# Altium schematic sheet USER_IO.SchDoc
size Tabloid; SheetNumber: 14; SheetTotal: 25; Sheet_Name: MECHANICAL; Size: 11x17
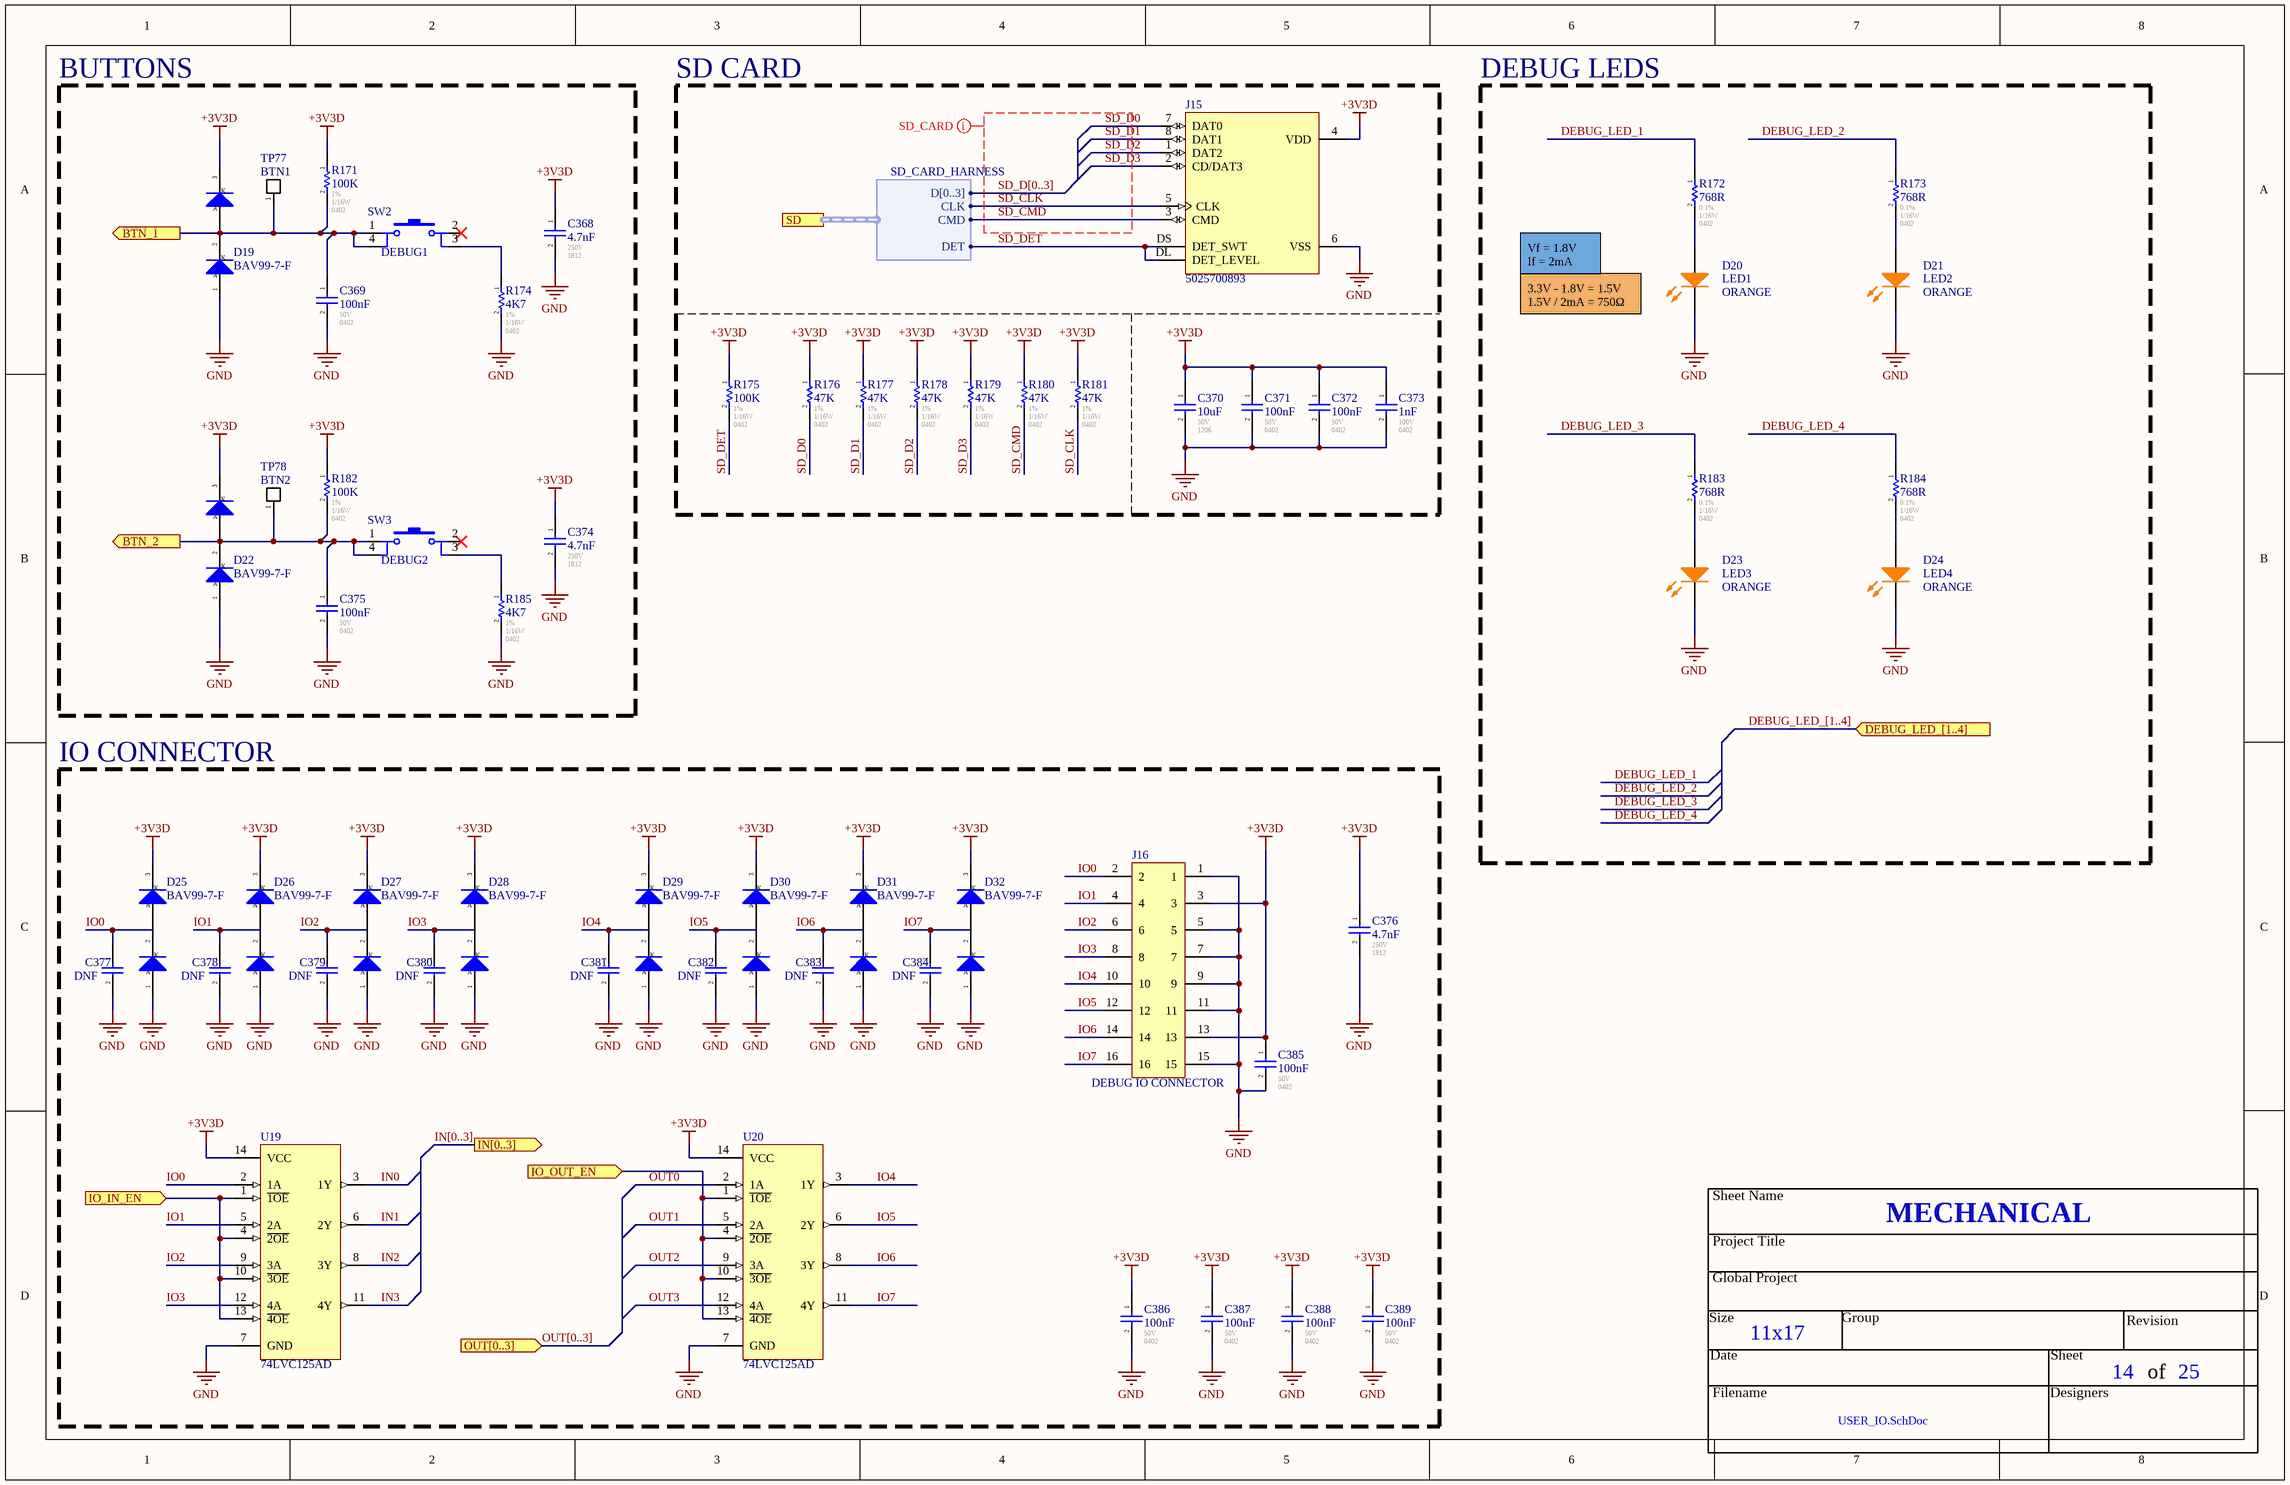
[diagram p0: USER_IO.SchDoc]

## Parts
C368  4.7nF  Voltage - Rated: 250V  Footprint: 1812  [CAP_1812]
C369  100nF  Voltage - Rated: 50V  Footprint: 0402  [CAP_0402]
C370  10uF  Voltage - Rated: 50V  Footprint: 1206  [CAP_1206]
C371  100nF  Voltage - Rated: 50V  Footprint: 0402  [CAP_0402]
C372  100nF  Voltage - Rated: 50V  Footprint: 0402  [CAP_0402]
C373  1nF  Voltage - Rated: 100V  Footprint: 0402  [CAP_0402]
C374  4.7nF  Voltage - Rated: 250V  Footprint: 1812  [CAP_1812]
C375  100nF  Voltage - Rated: 50V  Footprint: 0402  [CAP_0402]
C376  4.7nF  Voltage - Rated: 250V  Footprint: 1812  [CAP_1812]
C377  DNF  [CAP_0402]
C378  DNF  [CAP_0402]
C379  DNF  [CAP_0402]
C380  DNF  [CAP_0402]
C381  DNF  [CAP_0402]
C382  DNF  [CAP_0402]
C383  DNF  [CAP_0402]
C384  DNF  [CAP_0402]
C385  100nF  Voltage - Rated: 50V  Footprint: 0402  [CAP_0402]
C386  100nF  Voltage - Rated: 50V  Footprint: 0402  [CAP_0402]
C387  100nF  Voltage - Rated: 50V  Footprint: 0402  [CAP_0402]
C388  100nF  Voltage - Rated: 50V  Footprint: 0402  [CAP_0402]
C389  100nF  Voltage - Rated: 50V  Footprint: 0402  [CAP_0402]
D19  BAV99-7-F  [SOT23-3]
D20  LED1  value ORANGE  [LED_0603]
D21  LED2  value ORANGE  [LED_0603]
D22  BAV99-7-F  [SOT23-3]
D23  LED3  value ORANGE  [LED_0603]
D24  LED4  value ORANGE  [LED_0603]
D25  BAV99-7-F  [SOT23-3]
D26  BAV99-7-F  [SOT23-3]
D27  BAV99-7-F  [SOT23-3]
D28  BAV99-7-F  [SOT23-3]
D29  BAV99-7-F  [SOT23-3]
D30  BAV99-7-F  [SOT23-3]
D31  BAV99-7-F  [SOT23-3]
D32  BAV99-7-F  [SOT23-3]
J15  5025700893  [MICROSD_5025700893]
J16  DEBUG IO CONNECTOR  [HEADER-16_100MIL]
R171  100K  Tolerance: 1%  Power: 1/16W  Package / Case: 0402  [RES_0402]
R172  768R  Tolerance: 0.1%  Power: 1/16W  Package / Case: 0402  [RES_0402]
R173  768R  Tolerance: 0.1%  Power: 1/16W  Package / Case: 0402  [RES_0402]
R174  4K7  Tolerance: 1%  Power: 1/16W  Package / Case: 0402  [RES_0402]
R175  100K  Tolerance: 1%  Power: 1/16W  Package / Case: 0402  [RES_0402]
R176  47K  Tolerance: 1%  Power: 1/16W  Package / Case: 0402  [RES_0402]
R177  47K  Tolerance: 1%  Power: 1/16W  Package / Case: 0402  [RES_0402]
R178  47K  Tolerance: 1%  Power: 1/16W  Package / Case: 0402  [RES_0402]
R179  47K  Tolerance: 1%  Power: 1/16W  Package / Case: 0402  [RES_0402]
R180  47K  Tolerance: 1%  Power: 1/16W  Package / Case: 0402  [RES_0402]
R181  47K  Tolerance: 1%  Power: 1/16W  Package / Case: 0402  [RES_0402]
R182  100K  Tolerance: 1%  Power: 1/16W  Package / Case: 0402  [RES_0402]
R183  768R  Tolerance: 0.1%  Power: 1/16W  Package / Case: 0402  [RES_0402]
R184  768R  Tolerance: 0.1%  Power: 1/16W  Package / Case: 0402  [RES_0402]
R185  4K7  Tolerance: 1%  Power: 1/16W  Package / Case: 0402  [RES_0402]
SW2  DEBUG1  [SWI_TACT_B3SN-3012P]
SW3  DEBUG2  [SWI_TACT_B3SN-3012P]
TP77  BTN1  [TP_PAD]  (no BOM)
TP78  BTN2  [TP_PAD]  (no BOM)
U19  74LVC125AD  [SOIC-14_3.8MM]
U20  74LVC125AD  [SOIC-14_3.8MM]

## Blocks framed on the sheet
BUTTONS: C368 C369 C374 C375 D19 D22 R171 R174 R182 R185 SW2 SW3 TP77 TP78
SD CARD: C370-C373 J15 R175-R181
DEBUG LEDS: D20 D21 D23 D24 R172 R173 R183 R184
IO CONNECTOR: C376-C389 D25-D32 J16 U19 U20

## Ports
BTN_1 (out), BTN_2 (out), DEBUG_LED_[1..4] (in), IN[0..3] (out), IO_IN_EN (in), IO_OUT_EN (in), OUT[0..3] (in), SD (harness SD_CARD_HARNESS)

## Harnesses
SD_CARD_HARNESS: CMD, D[0..3], DET, CLK

## Nets
+3V3D: C368.1 C370.1 C371.1 C372.1 C373.1 C374.1 C376.1 C385.1 C386.1 C387.1 C388.1 C389.1 D19.3(K) D22.3(K) D25.3(K) D26.3(K) D27.3(K) D28.3(K) D29.3(K) D30.3(K) D31.3(K) D32.3(K) J15.4(VDD) J16.3 J16.13 R171.1 R175.1 R176.1 R177.1 R178.1 R179.1 R180.1 R181.1 R182.1 U19.14(VCC) U20.14(VCC)
GND: C368.2 C369.2 C370.2 C371.2 C372.2 C373.2 C374.2 C375.2 C376.2 C377.2 C378.2 C379.2 C380.2 C381.2 C382.2 C383.2 C384.2 C385.2 C386.2 C387.2 C388.2 C389.2 D19.1(A) D20.2(K) D21.2(K) D22.1(A) D23.2(K) D24.2(K) D25.1(A) D26.1(A) D27.1(A) D28.1(A) D29.1(A) D30.1(A) D31.1(A) D32.1(A) J15.6(VSS) J16.1 J16.5 J16.7 J16.9 J16.11 J16.15 R174.2 R185.2 U19.7(GND) U20.7(GND)
BTN_1: C369.1 D19.2(K) R171.2 SW2.1 SW2.4 TP77.1(A) ; port BTN_1
BTN_2: C375.1 D22.2(K) R182.2 SW3.1 SW3.4 TP78.1(A) ; port BTN_2
DEBUG_LED_1: R172.1
DEBUG_LED_2: R173.1
DEBUG_LED_3: R183.1
DEBUG_LED_4: R184.1
IN0: U19.3(1Y)
IN1: U19.6(2Y)
IN2: U19.8(3Y)
IN3: U19.11(4Y)
IO0: C377.1 D25.2(K) J16.2 U19.2(1A)
IO1: C378.1 D26.2(K) J16.4 U19.5(2A)
IO2: C379.1 D27.2(K) J16.6 U19.9(3A)
IO3: C380.1 D28.2(K) J16.8 U19.12(4A)
IO4: C381.1 D29.2(K) J16.10 U20.3(1Y)
IO5: C382.1 D30.2(K) J16.12 U20.6(2Y)
IO6: C383.1 D31.2(K) J16.14 U20.8(3Y)
IO7: C384.1 D32.2(K) J16.16 U20.11(4Y)
IO_IN_EN: U19.1(~{1OE}) U19.4(~{2OE}) U19.10(~{3OE}) U19.13(~{4OE}) ; port IO_IN_EN
IO_OUT_EN: U20.1(~{1OE}) U20.4(~{2OE}) U20.10(~{3OE}) U20.13(~{4OE}) ; port IO_OUT_EN
OUT0: U20.2(1A)
OUT1: U20.5(2A)
OUT2: U20.9(3A)
OUT3: U20.12(4A)
SD_CLK: J15.5(CLK) R181.2 ; port SD.CLK
SD_CMD: J15.3(CMD) R180.2 ; port SD.CMD
SD_D0: J15.7(DAT0) R176.2
SD_D1: J15.8(DAT1) R177.2
SD_D2: J15.1(DAT2) R178.2
SD_D3: J15.2(CD/DAT3) R179.2
SD_DET: J15.DL(DET_LEVEL) J15.DS(DET_SWT) R175.2 ; port SD.DET
NetD20_1: D20.1(A) R172.2
NetD21_1: D21.1(A) R173.2
NetD23_1: D23.1(A) R183.2
NetD24_1: D24.1(A) R184.2
NetR174_1: R174.1 SW2.3
NetR185_1: R185.1 SW3.3

Not connected (* = marked no-connect by the designer): SW2 2*; SW3 2*

## Buses and harness runs
bus DEBUG_LED_[1..4] = port DEBUG_LED_[1..4]
bus IN[0..3] = port IN[0..3]
bus OUT[0..3] = port OUT[0..3]
bus SD_D[0..3]

## Layout directives
net class SD_CARD: SD_CLK, SD_CMD, SD_D0, SD_D1, SD_D2, SD_D3, SD_D[0..3]

## Notes on the sheet
- Vf = 1.8V
  If = 2mA
- 3.3V - 1.8V = 1.5V
  1.5V / 2mA = 750Ω
- Sheet Name
- Project Title
- Global Project
- Revision
- Size
- Date
- Group
- Sheet
- of
- Filename
- Designers

## Library data of the parts
C368 C374 C376 = CAP_CER: GA343DR7GD472KW01L / 0402 4.7nF 10% X7R 1812 250VAC Ceramic Capacitor; Mfr: Murata; Ratings: Y3 - Safety; Operating Temperature: -55C - 125C; Temperature Coefficient: X7R; ComponentLink1Description: Digikey; ComponentLink1URL: https://www.digikey.ca/en/products/detail/murata-electronics/GA343DR7GD472KW01L/789292; ComponentLink2Description: Datasheet; ComponentLink2URL: https://search.murata.co.jp/Ceramy/image/img/A01X/G101/ENG/GA343DR7GD472KW01-01.pdf; ComponentLink3Description: Octopart; ComponentLink3URL: https://octopart.com/ga343dr7gd472kw01l-murata-197048?r=sp; Tolerance: 10%; Part#: GA343DR7GD472KW01L; ComponentLink4Description: Murata; ComponentLink4URL: https://www.murata.com/en-us/products/productdetail?partno=GA343DR7GD472KW01%23
C369 C371 C372 C375 C385-C389 = CAP_CER: GCM155R71H104KE02J / 0402 100nF 10% X7R Ceramic Capacitor; Mfr: Murata; Operating Temperature: -55C - 125C; Temperature Coefficient: X7R; ComponentLink1Description: Digikey; ComponentLink1URL: [Digikey Link]; Part#: GCM155R71H104KE02J; ComponentLink2Description: Datasheet; ComponentLink2URL: [Datasheet Link]; Tolerance: 10%; Ratings: AEC-Q200
C370 = CAP_CER: GRT31CR61H106KE01L / 1206 10uF 10% X5R Ceramic Capacitor; Mfr: Murata; Operating Temperature: -55C - 85C; Temperature Coefficient: X5R; ComponentLink1Description: Digikey; ComponentLink1URL: [Digikey Link]; ComponentLink2Description: Datasheet; ComponentLink2URL: [Datasheet Link]; Tolerance: 10%; Ratings: AEC-Q200; Supplier 1: Arrow Electronics; Supplier Part Number 1: GRT31CR61H106KE01L; Part#: GRT31CR61H106KE01L
C373 = CAP_CER: GCM155R72A102KA37D / 0402 1nF 10% X7R Ceramic Capacitor; Mfr: Murata; Operating Temperature: -55C - 125C; Temperature Coefficient: X7R; ComponentLink1Description: Digikey; ComponentLink1URL: [Digikey Link]; Part#: GCM155R72A102KA37D; ComponentLink2Description: Datasheet; ComponentLink2URL: [Datasheet Link]; Tolerance: 10%; Ratings: AEC-Q200
C377-C384 = CAP_CER: ComponentLink1Description: Digikey; ComponentLink1URL: [Digikey Link]; ComponentLink2Description: Datasheet; ComponentLink2URL: [Datasheet Link]
D19 D22 D25-D32 = DIODE_TVS_DUAL: Diode Array 1 Pair Series Connection 75 V 300mA (DC) Surface Mount TO-236-3, SC-59, SOT-23-3; Mfr: Diodes Incorporated; Voltage - DC Reverse: 75V; Voltage - Forward: 1.25V @ 150mA; Reverse Recovery Time: 4ns; Capacitance: 2pF; Current - Reverse Leakage: 2.5µA @ 75V; Operating Temperature: -65C - 150C; Package / Case: SOT-23-3; Current: 300mA; ComponentLink1Description: Digikey; ComponentLink1URL: https://www.digikey.ca/en/products/detail/diodes-incorporated/BAV99-7-F/815018; ComponentLink2Description: Datasheet; ComponentLink2URL: https://www.diodes.com/assets/Datasheets/BAV99.pdf; ComponentLink3Description: Octopart; ComponentLink3URL: https://octopart.com/bav99-7-f-diodes+inc.-326328; Supplier 1: Future Electronics; Supplier Part Number 1: 3851920
D20 D21 D23 D24 = LED_SML-311DTT86: LED - 611nM ORANGE 2mA - 0603; Voltage: 1.8V; Mfg: ROHM Semiconductor; Power: 44mW; Current: 2mA; HelpURL: http://media.digikey.com/pdf/Data%20Sheets/Rohm%20PDFs/SML-311%20Series.pdf; CreatedBy: Jonathan Bouchard; Temperature: -40°C to 85°C; Package: 0603; Precision: *; Mfg Part Number: SML-311DTT86; Supplier 1: Digikey; Supplier Part Number 1: 511-1303-1-ND
J15 = MICROSD_10: 10 (8 + 2) Position Card Connector Secure Digital - microSD™ Surface Mount, Right Angle Gold
J16 = HEADER_16
R171-R185 = RESISTOR: Automotive: AEC-Q200; Operating Temperature: *; # Digikey: *; ComponentLink1Description: Digikey; ComponentLink1URL: *; # Manufacturer: *
SW2 SW3 = SWI_TACT_B3SN-3012P: SWI - TACT SPST-NO 0.05A 24V - 4-SMD; Current: 50mA; Mfg: Omron; Mfg Part Number: B3SN-3012P; HelpURL: http://www.omron.com/ecb/products/pdf/en-b3sn.pdf; CreatedBy: Jonathan Bouchard; Temperature: -25°C ~ 70°C; Power: *; Precision: *; Package: 4-SMD; Value: *; Voltage: 24V; Supplier 1: Digikey; Supplier Part Number 1: SW261CT-ND
TP77 TP78 = TESTPOINT_PAD: Test Point
U19 U20 = 74LVC125AD,118: Buffer, Non-Inverting 4 Element 1 Bit per Element 3-State Output 14-SO; Mfr: Nexperia; Number of Elements: 4; Voltage - Supply: 1.2V - 3.6V; Output Type: 3-state; Operating Temperature: -40C - 125C; ComponentLink1Description: Digikey; ComponentLink1URL: https://www.digikey.ca/en/products/detail/nexperia-usa-inc/74LVC125AD-118/946677; ComponentLink2Description: Datasheet; ComponentLink2URL: https://assets.nexperia.com/documents/data-sheet/74LVC125A.pdf; ComponentLink3Description: Mfr; ComponentLink3URL: https://www.nexperia.com/products/analog-logic-ics/logic/buffers-inverters-transceivers/buffers/74LVC125AD.html; ComponentLink4Description: Octopart; ComponentLink4URL: https://octopart.com/74lvc125ad%2C118-nexperia-78737785?r=sp